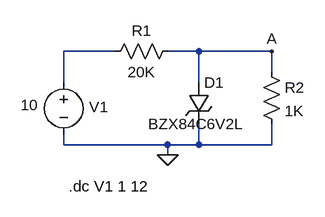
[diagram p0: schematic Zener Diode Forward Biased.asc]
Zener Diode Forward Biased.asc, the LTspice schematic file:
Version 4
SHEET 1 880 680
WIRE 112 80 32 80
WIRE 240 80 192 80
WIRE 352 80 240 80
WIRE 352 112 352 80
WIRE 32 128 32 80
WIRE 240 128 240 80
WIRE 32 224 32 208
WIRE 192 224 32 224
WIRE 240 224 240 192
WIRE 240 224 192 224
WIRE 352 224 352 192
WIRE 352 224 240 224
WIRE 192 240 192 224
FLAG 192 240 0
FLAG 352 80 A
SYMBOL zener 224 128 R0
WINDOW 3 -62 64 Left 2
SYMATTR InstName D1
SYMATTR Value BZX84C6V2L
SYMBOL voltage 32 112 R0
WINDOW 123 0 0 Left 0
WINDOW 39 0 0 Left 0
WINDOW 0 39 54 Left 2
WINDOW 3 -66 51 Left 2
SYMATTR InstName V1
SYMATTR Value 10
SYMBOL res 208 64 R90
WINDOW 0 0 56 VBottom 2
WINDOW 3 32 56 VTop 2
SYMATTR InstName R1
SYMATTR Value 20K
SYMBOL res 336 96 R0
SYMATTR InstName R2
SYMATTR Value 1K
TEXT 40 288 Left 2 !.dc V1 1 12

The netlist it stands for:
* Zener Diode Forward Biased.asc
D1 A 0 BZX84C6V2L
V1 N001 0 10
R1 A N001 20K
R2 A 0 1K
.model D D
.lib standard.dio
.dc V1 1 12
.backanno
.end